# Altium schematic sheet motor-control.SchDoc
size A4; DrawnBy: Lorna Lan, Dylan Vogel; Revision: v2; SheetNumber: 4; SheetTotal: 16
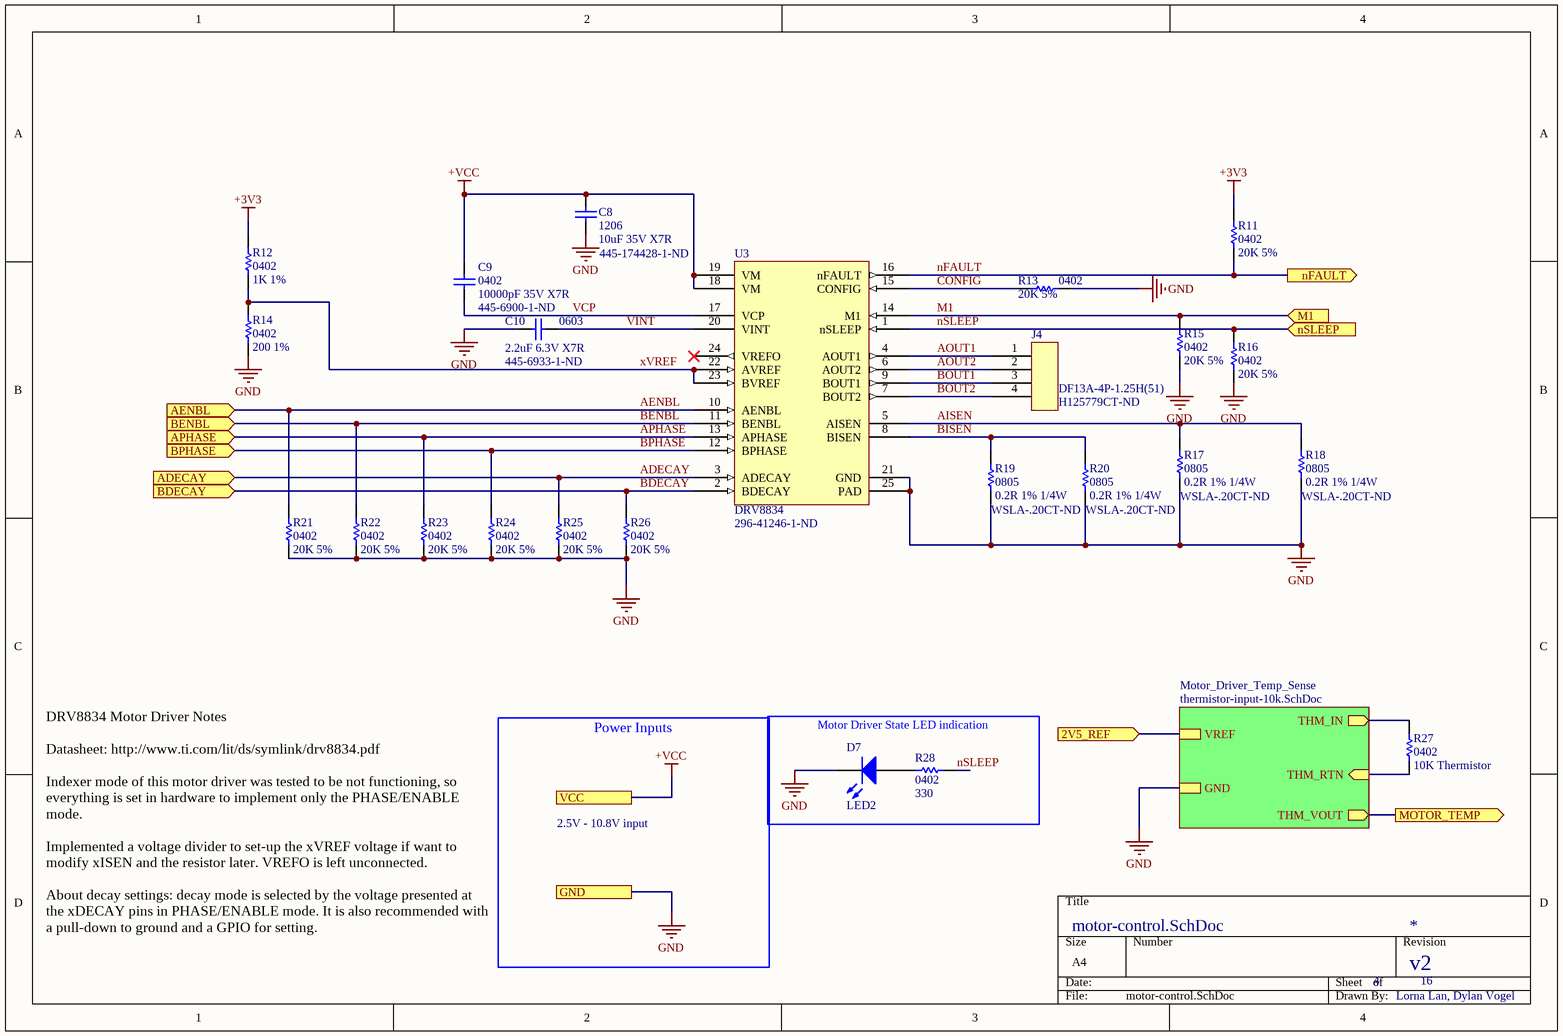
[diagram p0: motor-control.SchDoc]

## Parts
C8  1206  value 10uF 35V X7R  Supplier Part Number 1: 445-174428-1-ND  [CAP1206R]
C9  0402  value 10000pF 35V X7R  Supplier Part Number 1: 445-6900-1-ND  [CAP0402R]
C10  0603  value 2.2uF 6.3V X7R  Supplier Part Number 1: 445-6933-1-ND  [CAP0603R]
D7  LED2  [0603-LED]
J4  DF13A-4P-1.25H(51)  Supplier Part Number 1: H125779CT-ND  [DF13A-4P-1.25H(51)]
R11  0402  value 20K 5%  [RES0402R]
R12  0402  value 1K 1%  [RES0402R]
R13  0402  value 20K 5%  [RES0402R]
R14  0402  value 200 1%  [RES0402R]
R15  0402  value 20K 5%  [RES0402R]
R16  0402  value 20K 5%  [RES0402R]
R17  0805  value 0.2R 1% 1/4W  Supplier Part Number 1: WSLA-.20CT-ND  [RES0805R]
R18  0805  value 0.2R 1% 1/4W  Supplier Part Number 1: WSLA-.20CT-ND  [RES0805R]
R19  0805  value 0.2R 1% 1/4W  Supplier Part Number 1: WSLA-.20CT-ND  [RES0805R]
R20  0805  value 0.2R 1% 1/4W  Supplier Part Number 1: WSLA-.20CT-ND  [RES0805R]
R21  0402  value 20K 5%  [RES0402R]
R22  0402  value 20K 5%  [RES0402R]
R23  0402  value 20K 5%  [RES0402R]
R24  0402  value 20K 5%  [RES0402R]
R25  0402  value 20K 5%  [RES0402R]
R26  0402  value 20K 5%  [RES0402R]
R27  0402  value 10K Thermistor  [RES0402R]
R28  0402  value 330  [RES0402R]
U3  DRV8834  Supplier Part Number 1: 296-41246-1-ND  [SOP65P640X120-25N]

## Sub-sheets
Motor_Driver_Temp_Sense = thermistor-input-10k.SchDoc: GND, THM_VOUT (out), VREF, THM_IN (out), THM_RTN (in)

## Ports
2V5_REF (in), ADECAY (in), AENBL (in), APHASE (in), BDECAY (in), BENBL (in), BPHASE (in), GND, M1 (in), MOTOR_TEMP (out), nFAULT (out), nSLEEP (in), VCC

## Nets
+3V3: R11.2 R12.2
+VCC: C8.2 C9.2 U3.18(VM) U3.19(VM) ; port VCC
GND: C8.1 C10.2 D7.2(K) R13.1 R14.1 R15.1 R16.1 R17.1 R18.1 R19.1 R20.1 R21.1 R22.1 R23.1 R24.1 R25.1 R26.1 U3.21(GND) U3.25(PAD) ; port GND, sheet Motor_Driver_Temp_Sense/GND
2V5_REF: port 2V5_REF, sheet Motor_Driver_Temp_Sense/VREF
ADECAY: R25.2 U3.3(ADECAY) ; port ADECAY
AENBL: R21.2 U3.10(AENBL) ; port AENBL
AISEN: R17.2 R18.2 U3.5(AISEN)
AOUT1: J4.1 U3.4(AOUT1)
AOUT2: J4.2 U3.6(AOUT2)
APHASE: R23.2 U3.13(APHASE) ; port APHASE
BDECAY: R26.2 U3.2(BDECAY) ; port BDECAY
BENBL: R22.2 U3.11(BENBL) ; port BENBL
BISEN: R19.2 R20.2 U3.8(BISEN)
BOUT1: J4.3 U3.9(BOUT1)
BOUT2: J4.4 U3.7(BOUT2)
BPHASE: R24.2 U3.12(BPHASE) ; port BPHASE
CONFIG: R13.2 U3.15(CONFIG)
M1: R15.2 U3.14(M1) ; port M1
MOTOR_TEMP: port MOTOR_TEMP, sheet Motor_Driver_Temp_Sense/THM_VOUT
nFAULT: R11.1 U3.16(nFAULT) ; port nFAULT
nSLEEP: R16.2 R28.1 U3.1(nSLEEP) ; port nSLEEP
VCP: C9.1 U3.17(VCP)
VINT: C10.1 U3.20(VINT)
xVREF: R12.1 R14.2 U3.22(AVREF) U3.23(BVREF)
NetD7_1: D7.1(A) R28.2
NetR27_1: R27.1 ; sheet Motor_Driver_Temp_Sense/THM_RTN
NetR27_2: R27.2 ; sheet Motor_Driver_Temp_Sense/THM_IN

Not connected (* = marked no-connect by the designer): U3 24(VREFO)*

## Notes on the sheet
- 2.5V - 10.8V input
- Motor Driver State LED indication
- DRV8834 Motor Driver Notes
  Datasheet: http://www.ti.com/lit/ds/symlink/drv8834.pdf
  Indexer mode of this motor driver was tested to be not functioning, so everything is set in hardware to implement only the PHASE/ENABLE mode.
  Implemented a voltage divider to set-up the xVREF voltage if want to modify xISEN and the resistor later. VREFO is left unconnected.
  About decay settings: decay mode is selected by the voltage presented at the xDECAY pins in PHASE/ENABLE mode. It is also recommended with a pull-down to ground and a GPIO for setting.
- Power Inputs

## Library data of the parts
C8 = CAP1206: 1206 capacitor; Supplier 1: Digi-Key
C9 = CAP0402: 0402 capacitor; Supplier 1: Digi-Key
C10 = CAP0603: 0603 capacitor; Supplier 1: Digi-Key
D7 = LED2: Typical RED, GREEN, YELLOW, AMBER GaAs LED; Published: 8-Jun-2000; LatestRevisionDate: 17-Jul-2002; LatestRevisionNote: Re-released for DXP Platform.; PackageVersion: Feb-2002; PackageReference: 3.2X1.6X1.1; Publisher: Altium Limited; PackageDescription: SM LED; 2 Flat Leads
J4 = DF13A-4P-1.25H(51): 4 pos DF13 right angle surface mount connector; Supplier 1: Digi-Key
R11-R16 R21-R28 = RES0402: 0402 resistor
R17-R20 = RES0805: 0805 resistor; Supplier 1: Digi-Key
U3 = DRV8834: Dual-bridge stepper or dc motor driver. 1.5A per coil with 2.5-10.8 V load supply.; Supplier 1: Digi-Key; ComponentLink1Description: Datasheet; ComponentLink1URL: http://www.ti.com/lit/ds/symlink/drv8834.pdf